# EAGLE schematic charger (EAGLE 7.2.0)
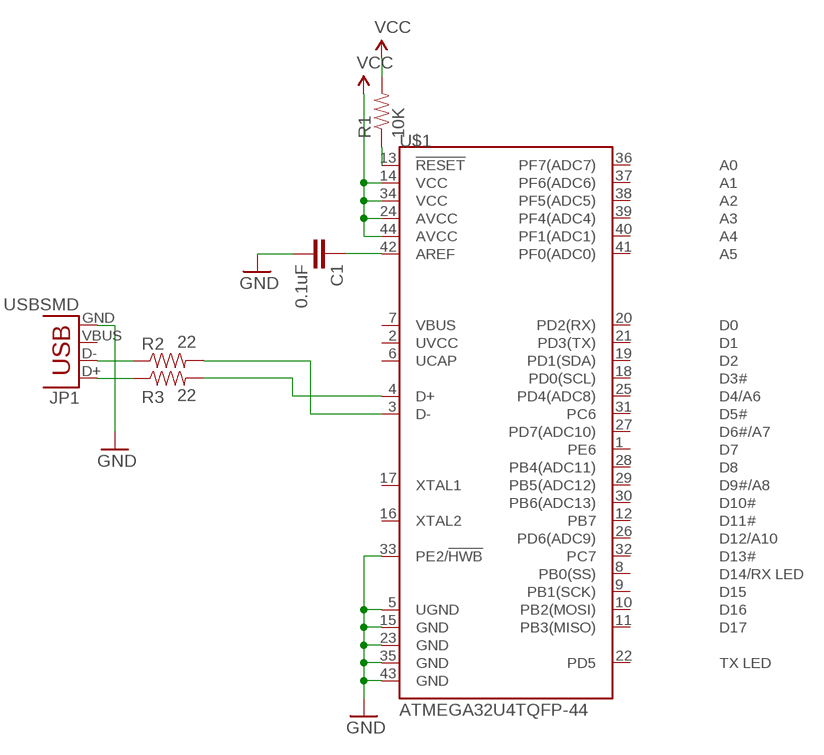
[diagram p0: schematic, sheet 1]

## Parts
C1  0.1uF  0.1UF-25V(+80/-20%)(0603)  [0603-CAP]
JP1  USBSMD  [USB-MINIB]
R1  10K  10KOHM-1/10W-1%(0603)0603  [0603-RES]
R2  22  22OHM1/10W1%(0603)  [0603-RES]
R3  22  22OHM1/10W1%(0603)  [0603-RES]
U$1  ATMEGA32U4TQFP-44  [TQFP44]

## Nets
GND: C1.2 JP1.GND U$1.5(UGND) U$1.15(GND) U$1.23(GND) U$1.33(PE2/!HWB) U$1.35(GND) U$1.43(GND)
N$1: R1.1 U$1.13(!RESET)
N$2: C1.1 U$1.42(AREF)
N$3: JP1.D- R2.1
N$4: JP1.D+ R3.1
N$5: R2.2 U$1.3(D-)
N$6: R3.2 U$1.4(D+)
VCC: R1.2 U$1.14(VCC) U$1.24(AVCC) U$1.34(VCC) U$1.44(AVCC)
Unconnected: JP1.VBUS U$1.1(PE6) U$1.2(UVCC) U$1.6(UCAP) U$1.7(VBUS) U$1.8(PB0(SS)) U$1.9(PB1(SCK)) U$1.10(PB2(MOSI)) U$1.11(PB3(MISO)) U$1.12(PB7) U$1.16(XTAL2) U$1.17(XTAL1) U$1.18(PD0(SCL)) U$1.19(PD1(SDA)) U$1.20(PD2(RX)) U$1.21(PD3(TX)) U$1.22(PD5) U$1.25(PD4(ADC8)) U$1.26(PD6(ADC9)) U$1.27(PD7(ADC10)) U$1.28(PB4(ADC11)) U$1.29(PB5(ADC12)) U$1.30(PB6(ADC13)) U$1.31(PC6) U$1.32(PC7) U$1.36(PF7(ADC7)) U$1.37(PF6(ADC6)) U$1.38(PF5(ADC5)) U$1.39(PF4(ADC4)) U$1.40(PF1(ADC1)) U$1.41(PF0(ADC0))

## Library data of the parts
C1 = SparkFun-Capacitors:0.1UF-25V(+80/-20%)(0603): CAP-00810 Ceramic Standard decoupling cap; PROD_ID: CAP-00810
JP1 = SparkFun-Connectors:USB: USB Connectors USB-B-PTH is fully proven SKU : PRT-00139/CONN-08278 USB-miniB is fully proven SKU : PRT-00587 USB-A-PCB is untested. USB-A-H is throughly reviewed, but untested. Spark Fun Electronics SKU : PRT-00437 USB-B-SMT is throughly reviewed, but untested. Needs silkscreen touching up. USB-A-S has not been used/tested USB-MB-H has not been used/tested USB-MICROB has been used. CONN-09505; PROD_ID: CONN-08193
R1 = SparkFun-Resistors:10KOHM-1/10W-1%(0603): RES-00824; PROD_ID: RES-00824
R2 R3 = SparkFun-Resistors:22OHM1/10W1%(0603): RES-08698; PROD_ID: RES-08698
U$1 = SparkFun-DigitalIC:ATMEGA32U4: Atmel 44-pin 8-bit Microcontroller with 32KBytes of ISP Flash and USB Controller